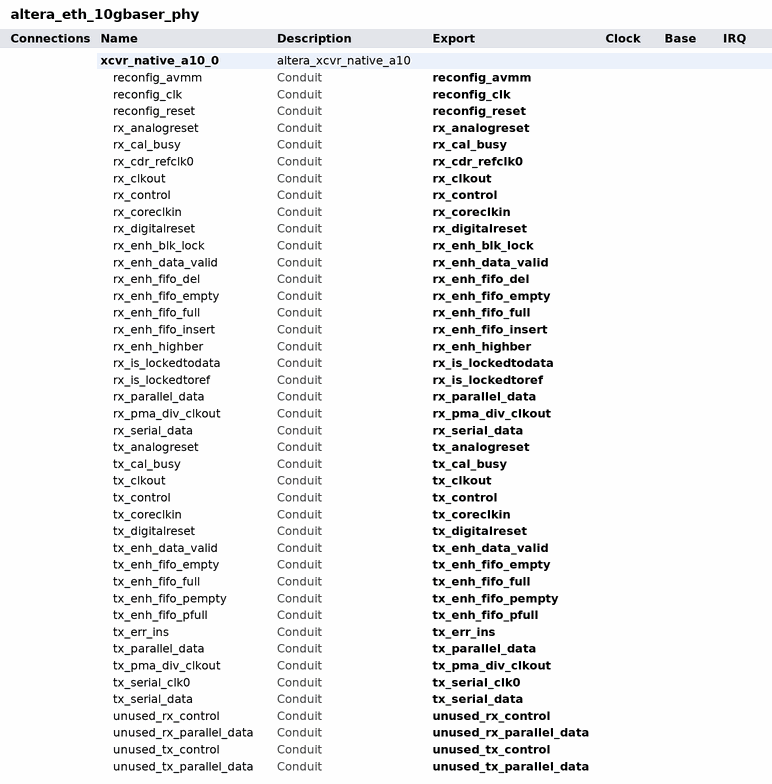
[diagram p0: system contents]
# Platform Designer (Qsys) system altera_eth_10gbaser_phy, Arria 10 10AX115N3F40E2SG
# Parameters at their usual value, and those the tool derives, are not listed.
package require -exact qsys 17.0
create_system altera_eth_10gbaser_phy
set_project_property DEVICE_FAMILY {Arria 10}
set_project_property DEVICE 10AX115N3F40E2SG

add_instance xcvr_native_a10_0 altera_xcvr_native_a10 17.0
set_instance_property xcvr_native_a10_0 AUTO_EXPORT true
set_instance_parameter_value xcvr_native_a10_0 anlg_tx_slew_rate_ctrl slew_r5
set_instance_parameter_value xcvr_native_a10_0 anlg_tx_vod_output_swing_ctrl 31
set_instance_parameter_value xcvr_native_a10_0 anlg_voltage 1_1V
set_instance_parameter_value xcvr_native_a10_0 base_device NIGHTFURY5
set_instance_parameter_value xcvr_native_a10_0 bonded_mode not_bonded
set_instance_parameter_value xcvr_native_a10_0 channels 1
set_instance_parameter_value xcvr_native_a10_0 disable_continuous_dfe false
set_instance_parameter_value xcvr_native_a10_0 enable_pcie_data_mask_option 0
set_instance_parameter_value xcvr_native_a10_0 enable_pcie_dfe_ip false
set_instance_parameter_value xcvr_native_a10_0 enable_port_rx_analog_reset_ack 0
set_instance_parameter_value xcvr_native_a10_0 enable_port_rx_enh_bitslip 0
set_instance_parameter_value xcvr_native_a10_0 enable_port_rx_enh_blk_lock 1
set_instance_parameter_value xcvr_native_a10_0 enable_port_rx_enh_clr_errblk_count 0
set_instance_parameter_value xcvr_native_a10_0 enable_port_rx_enh_data_valid 1
set_instance_parameter_value xcvr_native_a10_0 enable_port_rx_enh_fifo_del 1
set_instance_parameter_value xcvr_native_a10_0 enable_port_rx_enh_fifo_empty 1
set_instance_parameter_value xcvr_native_a10_0 enable_port_rx_enh_fifo_full 1
set_instance_parameter_value xcvr_native_a10_0 enable_port_rx_enh_fifo_insert 1
set_instance_parameter_value xcvr_native_a10_0 enable_port_rx_enh_fifo_rd_en 0
set_instance_parameter_value xcvr_native_a10_0 enable_port_rx_enh_highber 1
set_instance_parameter_value xcvr_native_a10_0 enable_port_rx_pma_clkout 0
set_instance_parameter_value xcvr_native_a10_0 enable_port_rx_pma_div_clkout 1
set_instance_parameter_value xcvr_native_a10_0 enable_port_rx_polinv 0
set_instance_parameter_value xcvr_native_a10_0 enable_port_rx_seriallpbken 0
set_instance_parameter_value xcvr_native_a10_0 enable_port_rx_seriallpbken_tx 0
set_instance_parameter_value xcvr_native_a10_0 enable_port_rx_std_bitslip 0
set_instance_parameter_value xcvr_native_a10_0 enable_port_tx_analog_reset_ack 0
set_instance_parameter_value xcvr_native_a10_0 enable_port_tx_enh_fifo_empty 1
set_instance_parameter_value xcvr_native_a10_0 enable_port_tx_enh_fifo_full 1
set_instance_parameter_value xcvr_native_a10_0 enable_port_tx_enh_fifo_pempty 1
set_instance_parameter_value xcvr_native_a10_0 enable_port_tx_enh_fifo_pfull 1
set_instance_parameter_value xcvr_native_a10_0 enable_port_tx_pma_clkout 0
set_instance_parameter_value xcvr_native_a10_0 enable_port_tx_pma_div_clkout 1
set_instance_parameter_value xcvr_native_a10_0 enable_port_tx_polinv 0
set_instance_parameter_value xcvr_native_a10_0 enable_ports_rx_manual_cdr_mode 0
set_instance_parameter_value xcvr_native_a10_0 enable_simple_interface 1
set_instance_parameter_value xcvr_native_a10_0 enable_skp_ports 0
set_instance_parameter_value xcvr_native_a10_0 enable_upi_pipeline_options 0
set_instance_parameter_value xcvr_native_a10_0 enh_pcs_pma_width 32
set_instance_parameter_value xcvr_native_a10_0 enh_pld_pcs_width 66
set_instance_parameter_value xcvr_native_a10_0 enh_rx_64b66b_enable 1
set_instance_parameter_value xcvr_native_a10_0 enh_rx_blksync_enable 1
set_instance_parameter_value xcvr_native_a10_0 enh_rx_descram_enable 1
set_instance_parameter_value xcvr_native_a10_0 enh_rxfifo_mode 10GBase-R
set_instance_parameter_value xcvr_native_a10_0 enh_tx_64b66b_enable 1
set_instance_parameter_value xcvr_native_a10_0 enh_tx_scram_enable 1
set_instance_parameter_value xcvr_native_a10_0 enh_tx_scram_seed 288230376151711743
set_instance_parameter_value xcvr_native_a10_0 enh_txfifo_mode {Phase compensation}
set_instance_parameter_value xcvr_native_a10_0 generate_add_hdl_instance_example 0
set_instance_parameter_value xcvr_native_a10_0 generate_docs 1
set_instance_parameter_value xcvr_native_a10_0 pcs_tx_delay1_ctrl delay1_path0
set_instance_parameter_value xcvr_native_a10_0 pcs_tx_delay1_data_sel one_ff_delay
set_instance_parameter_value xcvr_native_a10_0 pcs_tx_delay2_ctrl delay2_path0
set_instance_parameter_value xcvr_native_a10_0 protocol_mode teng_baser_mode
set_instance_parameter_value xcvr_native_a10_0 rcfg_file_prefix altera_xcvr_native_a10
set_instance_parameter_value xcvr_native_a10_0 rcfg_h_file_enable 1
set_instance_parameter_value xcvr_native_a10_0 rcfg_iface_enable 0
set_instance_parameter_value xcvr_native_a10_0 rcfg_jtag_enable 1
set_instance_parameter_value xcvr_native_a10_0 rcfg_mif_file_enable 0
set_instance_parameter_value xcvr_native_a10_0 rcfg_multi_enable 0
set_instance_parameter_value xcvr_native_a10_0 rcfg_profile_cnt 2
set_instance_parameter_value xcvr_native_a10_0 rcfg_profile_select 1
set_instance_parameter_value xcvr_native_a10_0 rcfg_reduced_files_enable 0
set_instance_parameter_value xcvr_native_a10_0 rcfg_separate_avmm_busy 0
set_instance_parameter_value xcvr_native_a10_0 rcfg_shared 0
set_instance_parameter_value xcvr_native_a10_0 rcfg_sv_file_enable 0
set_instance_parameter_value xcvr_native_a10_0 rx_pma_div_clkout_divider 2
set_instance_parameter_value xcvr_native_a10_0 set_capability_reg_enable 1
set_instance_parameter_value xcvr_native_a10_0 set_cdr_refclk_freq 644.531250
set_instance_parameter_value xcvr_native_a10_0 set_csr_soft_logic_enable 1
set_instance_parameter_value xcvr_native_a10_0 set_data_rate 10312.5
set_instance_parameter_value xcvr_native_a10_0 set_disconnect_analog_resets 0
set_instance_parameter_value xcvr_native_a10_0 set_enable_calibration 0
set_instance_parameter_value xcvr_native_a10_0 set_odi_soft_logic_enable 0
set_instance_parameter_value xcvr_native_a10_0 set_prbs_soft_logic_enable 1
set_instance_parameter_value xcvr_native_a10_0 sim_reduced_counters false
set_instance_parameter_value xcvr_native_a10_0 std_data_mask_count_multi 0
set_instance_parameter_value xcvr_native_a10_0 std_pcs_pma_width 10
set_instance_parameter_value xcvr_native_a10_0 std_rx_8b10b_enable 0
set_instance_parameter_value xcvr_native_a10_0 std_rx_byte_deser_mode Disabled
set_instance_parameter_value xcvr_native_a10_0 std_rx_polinv_enable 0
set_instance_parameter_value xcvr_native_a10_0 std_rx_word_aligner_mode bitslip
set_instance_parameter_value xcvr_native_a10_0 std_rx_word_aligner_pattern_len 7
set_instance_parameter_value xcvr_native_a10_0 std_tx_8b10b_enable 0
set_instance_parameter_value xcvr_native_a10_0 std_tx_byte_ser_mode Disabled
set_instance_parameter_value xcvr_native_a10_0 std_tx_polinv_enable 0
set_instance_parameter_value xcvr_native_a10_0 tx_pma_div_clkout_divider 2

# exported interfaces
add_interface reconfig_avmm conduit end
set_interface_property reconfig_avmm EXPORT_OF xcvr_native_a10_0.reconfig_avmm
add_interface reconfig_clk conduit end
set_interface_property reconfig_clk EXPORT_OF xcvr_native_a10_0.reconfig_clk
add_interface reconfig_reset conduit end
set_interface_property reconfig_reset EXPORT_OF xcvr_native_a10_0.reconfig_reset
add_interface rx_analogreset conduit end
set_interface_property rx_analogreset EXPORT_OF xcvr_native_a10_0.rx_analogreset
add_interface rx_cal_busy conduit end
set_interface_property rx_cal_busy EXPORT_OF xcvr_native_a10_0.rx_cal_busy
add_interface rx_cdr_refclk0 conduit end
set_interface_property rx_cdr_refclk0 EXPORT_OF xcvr_native_a10_0.rx_cdr_refclk0
add_interface rx_clkout conduit end
set_interface_property rx_clkout EXPORT_OF xcvr_native_a10_0.rx_clkout
add_interface rx_control conduit end
set_interface_property rx_control EXPORT_OF xcvr_native_a10_0.rx_control
add_interface rx_coreclkin conduit end
set_interface_property rx_coreclkin EXPORT_OF xcvr_native_a10_0.rx_coreclkin
add_interface rx_digitalreset conduit end
set_interface_property rx_digitalreset EXPORT_OF xcvr_native_a10_0.rx_digitalreset
add_interface rx_enh_blk_lock conduit end
set_interface_property rx_enh_blk_lock EXPORT_OF xcvr_native_a10_0.rx_enh_blk_lock
add_interface rx_enh_data_valid conduit end
set_interface_property rx_enh_data_valid EXPORT_OF xcvr_native_a10_0.rx_enh_data_valid
add_interface rx_enh_fifo_del conduit end
set_interface_property rx_enh_fifo_del EXPORT_OF xcvr_native_a10_0.rx_enh_fifo_del
add_interface rx_enh_fifo_empty conduit end
set_interface_property rx_enh_fifo_empty EXPORT_OF xcvr_native_a10_0.rx_enh_fifo_empty
add_interface rx_enh_fifo_full conduit end
set_interface_property rx_enh_fifo_full EXPORT_OF xcvr_native_a10_0.rx_enh_fifo_full
add_interface rx_enh_fifo_insert conduit end
set_interface_property rx_enh_fifo_insert EXPORT_OF xcvr_native_a10_0.rx_enh_fifo_insert
add_interface rx_enh_highber conduit end
set_interface_property rx_enh_highber EXPORT_OF xcvr_native_a10_0.rx_enh_highber
add_interface rx_is_lockedtodata conduit end
set_interface_property rx_is_lockedtodata EXPORT_OF xcvr_native_a10_0.rx_is_lockedtodata
add_interface rx_is_lockedtoref conduit end
set_interface_property rx_is_lockedtoref EXPORT_OF xcvr_native_a10_0.rx_is_lockedtoref
add_interface rx_parallel_data conduit end
set_interface_property rx_parallel_data EXPORT_OF xcvr_native_a10_0.rx_parallel_data
add_interface rx_pma_div_clkout conduit end
set_interface_property rx_pma_div_clkout EXPORT_OF xcvr_native_a10_0.rx_pma_div_clkout
add_interface rx_serial_data conduit end
set_interface_property rx_serial_data EXPORT_OF xcvr_native_a10_0.rx_serial_data
add_interface tx_analogreset conduit end
set_interface_property tx_analogreset EXPORT_OF xcvr_native_a10_0.tx_analogreset
add_interface tx_cal_busy conduit end
set_interface_property tx_cal_busy EXPORT_OF xcvr_native_a10_0.tx_cal_busy
add_interface tx_clkout conduit end
set_interface_property tx_clkout EXPORT_OF xcvr_native_a10_0.tx_clkout
add_interface tx_control conduit end
set_interface_property tx_control EXPORT_OF xcvr_native_a10_0.tx_control
add_interface tx_coreclkin conduit end
set_interface_property tx_coreclkin EXPORT_OF xcvr_native_a10_0.tx_coreclkin
add_interface tx_digitalreset conduit end
set_interface_property tx_digitalreset EXPORT_OF xcvr_native_a10_0.tx_digitalreset
add_interface tx_enh_data_valid conduit end
set_interface_property tx_enh_data_valid EXPORT_OF xcvr_native_a10_0.tx_enh_data_valid
add_interface tx_enh_fifo_empty conduit end
set_interface_property tx_enh_fifo_empty EXPORT_OF xcvr_native_a10_0.tx_enh_fifo_empty
add_interface tx_enh_fifo_full conduit end
set_interface_property tx_enh_fifo_full EXPORT_OF xcvr_native_a10_0.tx_enh_fifo_full
add_interface tx_enh_fifo_pempty conduit end
set_interface_property tx_enh_fifo_pempty EXPORT_OF xcvr_native_a10_0.tx_enh_fifo_pempty
add_interface tx_enh_fifo_pfull conduit end
set_interface_property tx_enh_fifo_pfull EXPORT_OF xcvr_native_a10_0.tx_enh_fifo_pfull
add_interface tx_err_ins conduit end
set_interface_property tx_err_ins EXPORT_OF xcvr_native_a10_0.tx_err_ins
add_interface tx_parallel_data conduit end
set_interface_property tx_parallel_data EXPORT_OF xcvr_native_a10_0.tx_parallel_data
add_interface tx_pma_div_clkout conduit end
set_interface_property tx_pma_div_clkout EXPORT_OF xcvr_native_a10_0.tx_pma_div_clkout
add_interface tx_serial_clk0 conduit end
set_interface_property tx_serial_clk0 EXPORT_OF xcvr_native_a10_0.tx_serial_clk0
add_interface tx_serial_data conduit end
set_interface_property tx_serial_data EXPORT_OF xcvr_native_a10_0.tx_serial_data
add_interface unused_rx_control conduit end
set_interface_property unused_rx_control EXPORT_OF xcvr_native_a10_0.unused_rx_control
add_interface unused_rx_parallel_data conduit end
set_interface_property unused_rx_parallel_data EXPORT_OF xcvr_native_a10_0.unused_rx_parallel_data
add_interface unused_tx_control conduit end
set_interface_property unused_tx_control EXPORT_OF xcvr_native_a10_0.unused_tx_control
add_interface unused_tx_parallel_data conduit end
set_interface_property unused_tx_parallel_data EXPORT_OF xcvr_native_a10_0.unused_tx_parallel_data

set_interconnect_requirement {$system} qsys_mm.clockCrossingAdapter HANDSHAKE
set_interconnect_requirement {$system} qsys_mm.insertDefaultSlave FALSE
set_interconnect_requirement {$system} qsys_mm.maxAdditionalLatency 1

save_system altera_eth_10gbaser_phy.qsys
